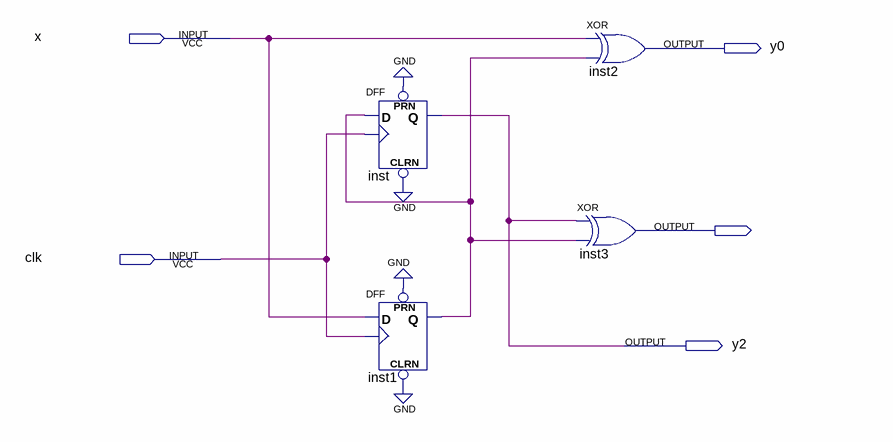
[diagram p0: schematic sheet]
// Quartus schematic FSM_Mealy.bdf as structural Verilog: 4 symbols, 5 pins
module FSM_Mealy (
  input  x,
  input  clk,
  output y0,
  output y2
);

  wire inst1_q;

  DFF inst (.CLRN(1'b0), .CLK(clk), .D(inst1_q), .PRN(1'b0), .Q(y2));
  DFF inst1 (.CLRN(1'b0), .CLK(clk), .D(x), .PRN(1'b0), .Q(inst1_q));
  xor inst2 (y0, x, inst1_q);
  // XOR inst3 has open pins: IN1=y2, IN2=inst1_q, OUT=open
endmodule
